# Altium schematic sheet PC2_Codec.SchDoc
size A4
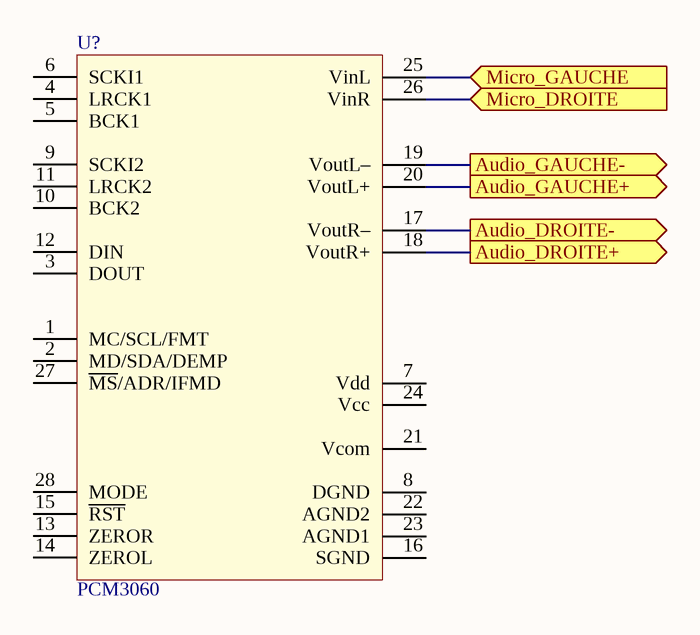
[diagram p0: PC2_Codec.SchDoc]

## Parts
U?  PCM3060

## Ports
Audio_DROITE+ (out), Audio_DROITE- (out), Audio_GAUCHE+ (out), Audio_GAUCHE- (out), Micro_DROITE (in), Micro_GAUCHE (in)

## Nets
Audio_DROITE+: U?.18(VoutR+) ; port Audio_DROITE+
Audio_DROITE-: U?.17(VoutR–) ; port Audio_DROITE-
Audio_GAUCHE+: U?.20(VoutL+) ; port Audio_GAUCHE+
Audio_GAUCHE-: U?.19(VoutL–) ; port Audio_GAUCHE-
Micro_DROITE: U?.26(VinR) ; port Micro_DROITE
Micro_GAUCHE: U?.25(VinL) ; port Micro_GAUCHE

Not connected (* = marked no-connect by the designer): U? 1(MC/SCL/FMT) 2(MD/SDA/DEMP) 3(DOUT) 4(LRCK1) 5(BCK1) 6(SCKI1) 7(Vdd) 8(DGND) 9(SCKI2) 10(BCK2) 11(LRCK2) 12(DIN) 13(ZEROR) 14(ZEROL) 15(~{RST}) 16(SGND) 21(Vcom) 22(AGND2) 23(AGND1) 24(Vcc) 27(~{MS}/ADR/IFMD) 28(MODE)

## Library data of the parts
U? = PCM3060: Stéréo In/Out Audio Codec; Fabricant: TEXAS INSTRUMENTS; RefFabricant: PCM3060PW; Datasheet: http://www.ti.com/lit/ds/symlink/pcm3060.pdf